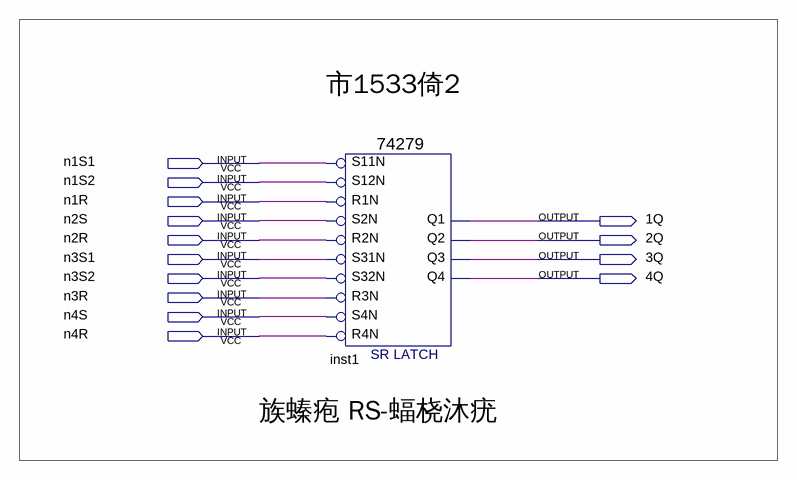
[diagram p0: schematic sheet]
// Quartus schematic KP1533TP2.bdf as structural Verilog: 1 symbols, 14 pins
module KP1533TP2 (
  input  n1S1,
  input  n1S2,
  input  n1R,
  input  n2S,
  input  n2R,
  input  n3S1,
  input  n3S2,
  input  n3R,
  input  n4S,
  input  n4R,
  output \1Q ,
  output \2Q ,
  output \3Q ,
  output \4Q 
);

  \74279  inst1 (
    .R1N(n1R), .S12N(n1S2), .S11N(n1S1), .R2N(n2R), .S31N(n3S1), .S32N(n3S2), .S4N(n4S), .R4N(n4R),
    .S2N(n2S), .R3N(n3R), .Q2(\2Q ), .Q1(\1Q ), .Q3(\3Q ), .Q4(\4Q ));

  // Notes on the sheet:
  //   市1533倚2
  //   族螓疱 RS-蝠桡沐疣
endmodule
